# Altium project ADAS_ECU_revA.PrjPcb (part 4 of 6)

## Sheet LM704A0_3V3_PINOUT.SchDoc
size C; SheetNumber: 9; SheetTotal: 25
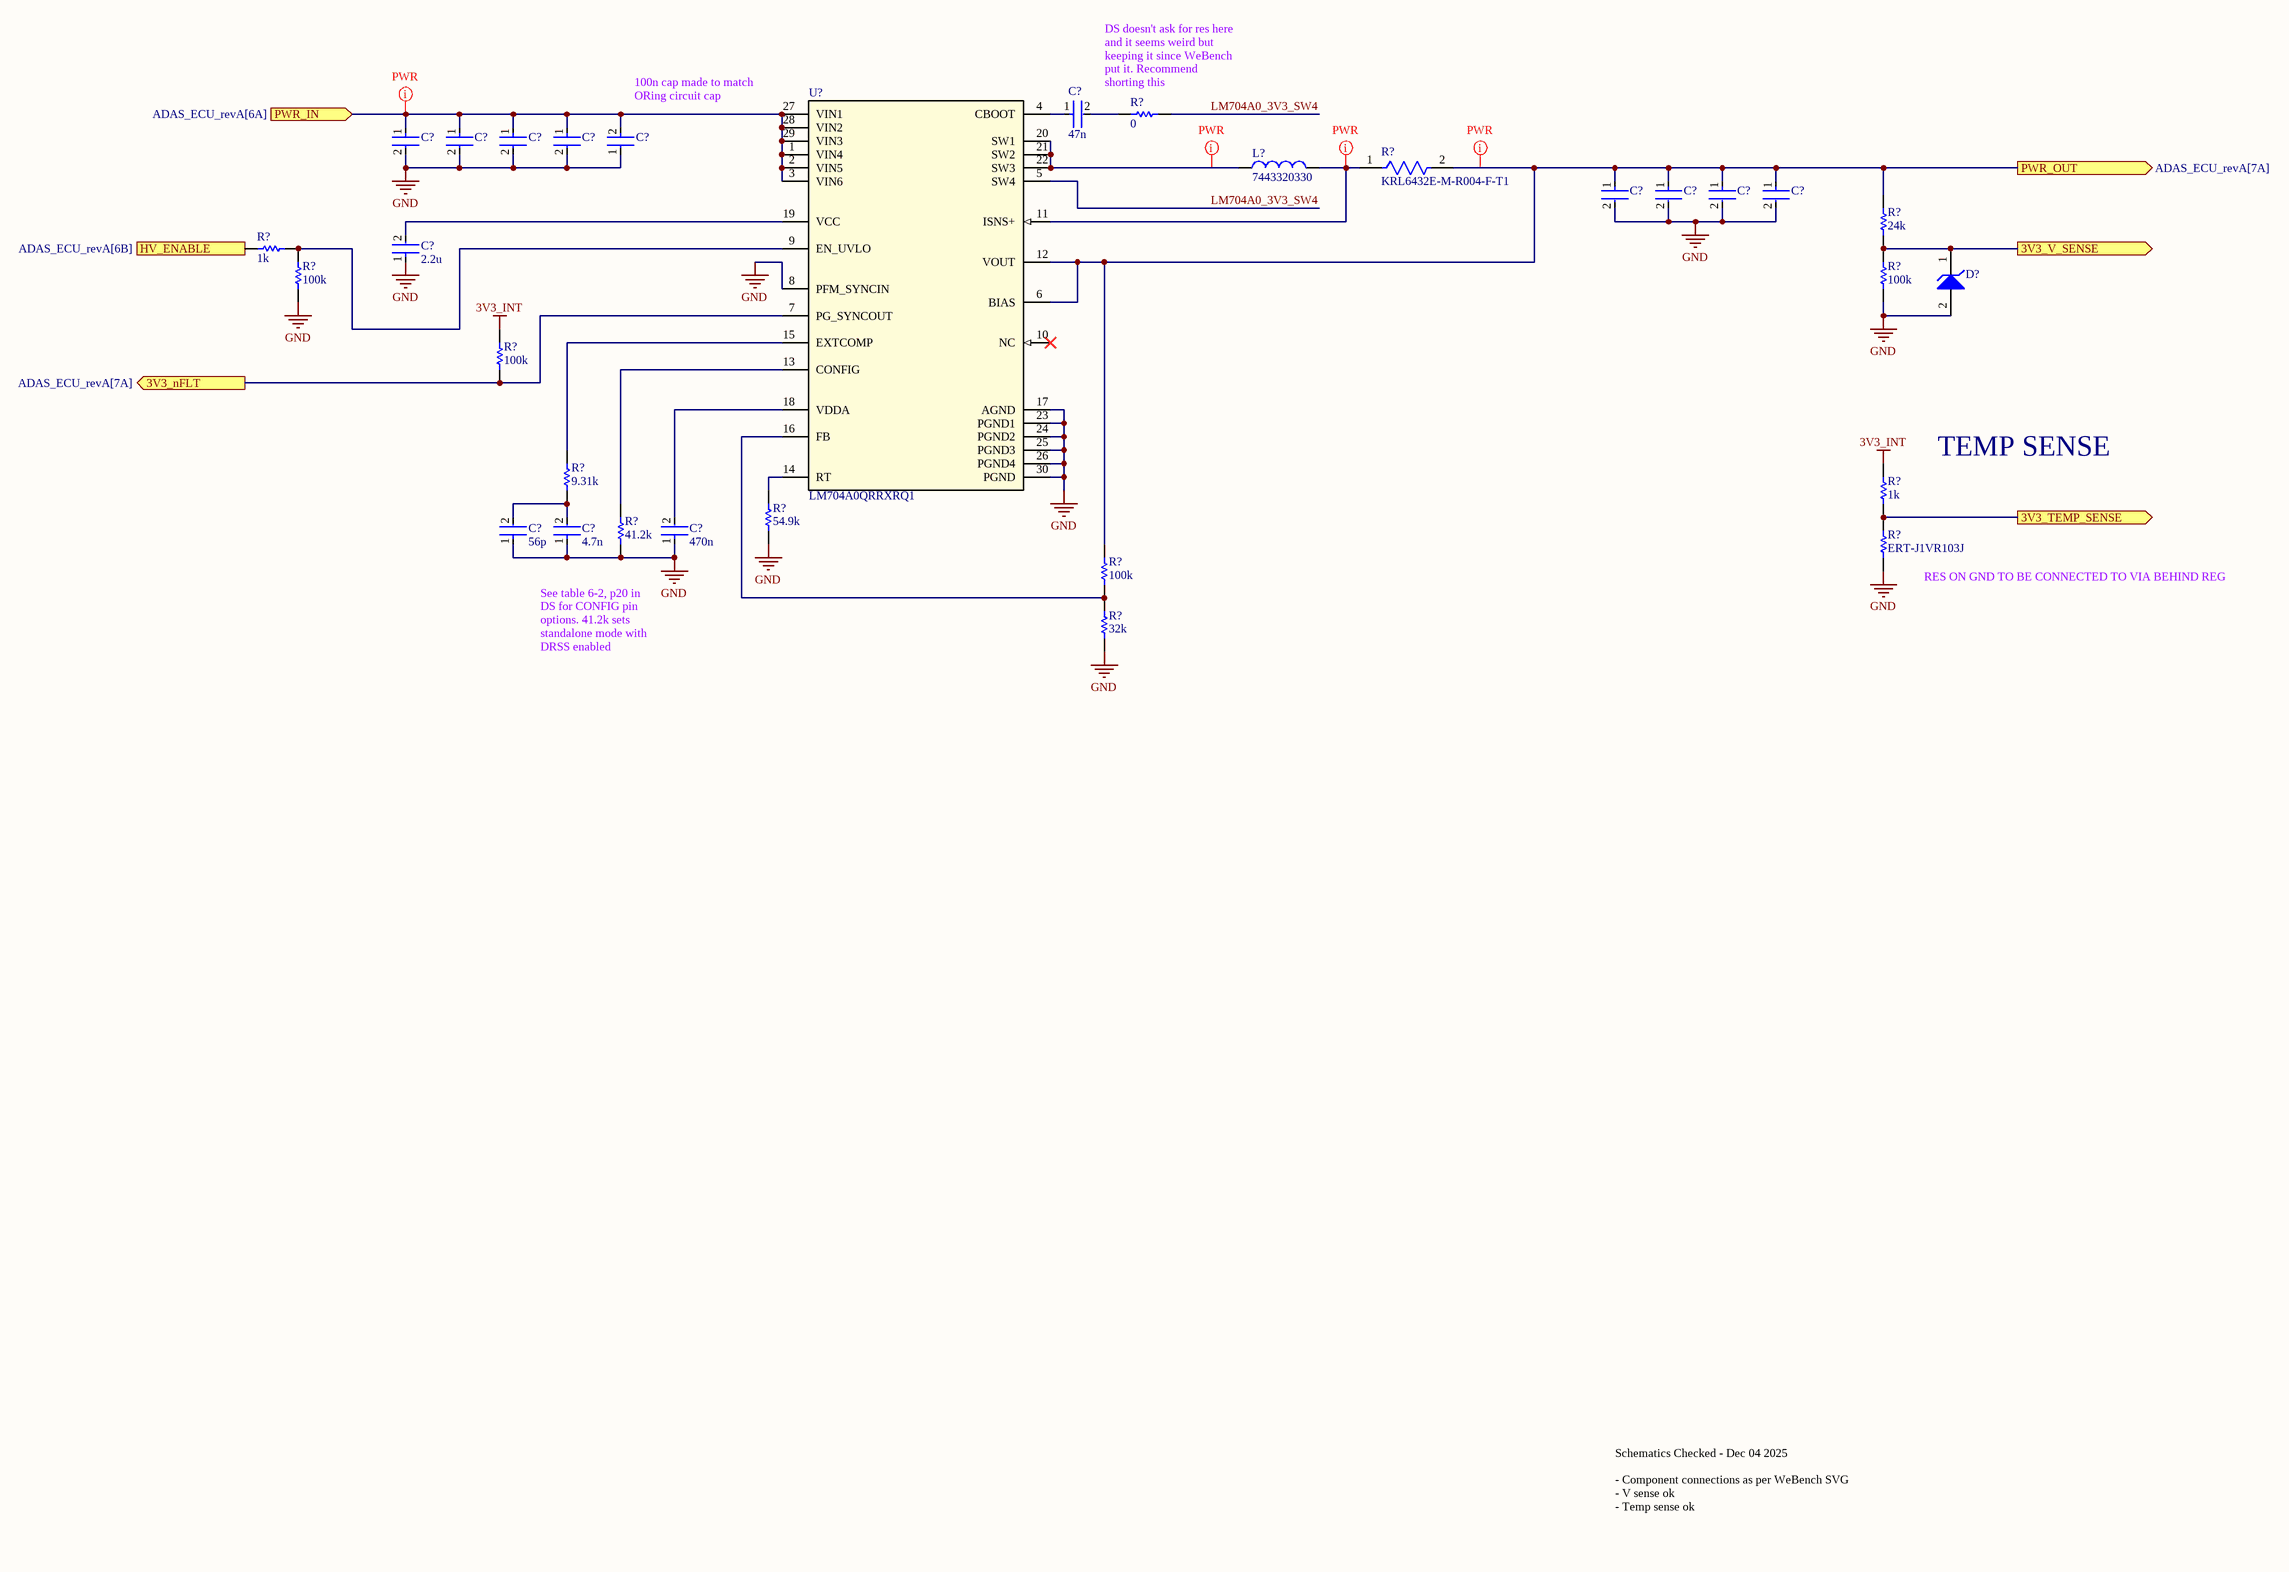
[diagram p29: LM704A0_3V3_PINOUT.SchDoc]

### Parts
(Parts that share a designator on the sheet are numbered #1, #2 ... from top to bottom, then left to right.)
C?#17  47n  [FP-0402-L_1_0_0_05-W_0_5-IPC_A]
C?#18  C3225X7R1H106M250AC  [FP-C3225-250-0_4-MFG]  (value not drawn)
C?#19  C3225X7R1H106M250AC  [FP-C3225-250-0_4-MFG]  (value not drawn)
C?#20  C3225X7R1H106M250AC  [FP-C3225-250-0_4-MFG]  (value not drawn)
C?#21  C3225X7R1H106M250AC  [FP-C3225-250-0_4-MFG]  (value not drawn)
C?#22  AC1210KKX7R0BB104  [FP-AC1210-0_85-MFG]  (value not drawn)
C?#23  GRM32EC80J107ME20L  [FP-GRM32E-0_3-0_2-IPC_C]  (value not drawn)
C?#24  GRM32EC80J107ME20L  [FP-GRM32E-0_3-0_2-IPC_C]  (value not drawn)
C?#25  GRM32EC80J107ME20L  [FP-GRM32E-0_3-0_2-IPC_C]  (value not drawn)
C?#26  GRM32EC80J107ME20L  [FP-GRM32E-0_3-0_2-IPC_C]  (value not drawn)
C?#27  2.2u  [FP-0402-L_1_0_0_05-W_0_5-IPC_A]
C?#28  56p  [FP-0402-L_1_0_0_05-W_0_5-IPC_A]
C?#29  4.7n  [FP-0402-L_1_0_0_05-W_0_5-IPC_A]
C?#30  470n  [FP-0402-L_1_0_0_05-W_0_5-IPC_A]
D?#4  DNP/MM5Z3V3T1G  [ONSC-SOD-523-2-502-01_V]  (value not drawn)
L?  7443320330  [WE-HCC_1210]
R?#10  0  [R0603B]
R?#11  KRL6432E-M-R004-F-T1  [FP-KRL6432E-MFG]
R?#12  24k  [R0603B]
R?#13  1k  [R0603B]
R?#14  100k  [R0603B]
R?#15  100k  [R0603B]
R?#16  100k  [R0603B]
R?#17  9.31k  [R0603B]
R?#18  1k  [R0603B]
R?#19  54.9k  [R0603B]
R?#20  41.2k  [R0603B]
R?#21  ERT-J1VR103J  [RESC1608X90X30ML15T20]
R?#22  100k  [R0603B]
R?#23  32k  [R0603B]
U?#3  LM704A0QRRXRQ1  [LM704A0QRRXRQ1-Footprint-1]

### Ports
3V3_nFLT (out, see ADAS_ECU_revA[7A]), 3V3_TEMP_SENSE (out), 3V3_V_SENSE (out), HV_ENABLE (in, see ADAS_ECU_revA[6B]), PWR_IN (in, see ADAS_ECU_revA[6A]), PWR_OUT (out, see ADAS_ECU_revA[7A])

### Nets
3V3_INT: R?#16.2 R?#18.1
3V3_MAIN: C?#23.1 C?#24.1 C?#25.1 C?#26.1 R?#11.2 R?#12.1 R?#22.1 U?#3.6(BIAS) U?#3.12(VOUT) ; port PWR_OUT
GND: C?#18.2 C?#19.2 C?#20.2 C?#21.2 C?#22.1 C?#23.2 C?#24.2 C?#25.2 C?#26.2 C?#27.1 C?#28.1 C?#29.1 C?#30.1 D?#4.2(A) R?#14.1 R?#15.2 R?#19.2 R?#20.2 R?#21.1 R?#23.2 U?#3.8(PFM_SYNCIN) U?#3.17(AGND) U?#3.23(PGND1) U?#3.24(PGND2) U?#3.25(PGND3) U?#3.26(PGND4) U?#3.30(PGND)
3V3_3V3_MAIN_ENABLE: R?#13.2 ; port HV_ENABLE
3V3_3V3_MAIN_nFLT: R?#16.1 U?#3.7(PG_SYNCOUT) ; port 3V3_nFLT
3V3_3V3_MAIN_T_SENSE: R?#18.2 R?#21.2 ; port 3V3_TEMP_SENSE
3V3_3V3_MAIN_V_SENSE: D?#4.1(K) R?#12.2 R?#15.1 ; port 3V3_V_SENSE
3V3_MAIN_PWR_IN: C?#18.1 C?#19.1 C?#20.1 C?#21.1 C?#22.2 U?#3.1(VIN4) U?#3.2(VIN5) U?#3.3(VIN6) U?#3.27(VIN1) U?#3.28(VIN2) U?#3.29(VIN3) ; port PWR_IN
LM704A0_3V3_SW4: R?#10.2 U?#3.5(SW4)
NetC?#17_1: C?#17.1 U?#3.4(CBOOT)
NetC?#17_2: C?#17.2 R?#10.1
NetC?#27_2: C?#27.2 U?#3.19(VCC)
NetC?#28_2: C?#28.2 C?#29.2 R?#17.2
NetC?#30_2: C?#30.2 U?#3.18(VDDA)
NetL?_1: L?.1 U?#3.20(SW1) U?#3.21(SW2) U?#3.22(SW3)
NetL?_2: L?.2 R?#11.1 U?#3.11(ISNS+)
NetR?#13_1: R?#13.1 R?#14.2 U?#3.9(EN_UVLO)
NetR?#17_1: R?#17.1 U?#3.15(EXTCOMP)
NetR?#19_1: R?#19.1 U?#3.14(RT)
NetR?#20_1: R?#20.1 U?#3.13(CONFIG)
NetR?#22_2: R?#22.2 R?#23.1 U?#3.16(FB)

Not connected (* = marked no-connect by the designer): U?#3 10(NC)*

### Layout directives
net class PWR: 3V3_MAIN, 3V3_MAIN_PWR_IN, NetL?_1, NetL?_2

### Notes on the sheet
- 100n cap made to match ORing circuit cap
- DS doesn't ask for res here and it seems weird but keeping it since WeBench put it. Recommend shorting this
- TEMP SENSE
- (near R?#21) RES ON GND TO BE CONNECTED TO VIA BEHIND REG
- See table 6-2, p20 in DS for CONFIG pin options. 41.2k sets standalone mode with DRSS enabled
- Schematics Checked - Dec 04 2025
  - Component connections as per WeBench SVG
  - V sense ok
  - Temp sense ok

### Library data of the parts
C?#17 C?#27-C?#30 = CMP-001-00058-1: as C66-C70 on sheet LM74910H_PINOUT; Min Operating Temperature: -55°C; Mounting Technology: Surface Mount; Pins: 2; Case/Package: 0402; RoHS Compliant: Yes; Max Operating Temperature: 85°C
C?#18-C?#21 = CMP-08246-002653-1: Multilayer Ceramic Capacitors 10uF ±20% 50V X7R SMD 1210; Width: 0.098inch; Package Quantity: 1000; Height: 2.5mm; Dielectric Material: Ceramic; Voltage Rating: 50V; Series: C; Capacitance: 10uF; Tolerance: 20%; Weight: 0.000564oz; Case/Package: 1210; Case Code (Imperial): 1210; Dielectric: X7R; Case Code (Metric): 3225; REACH SVHC: No SVHC; Packaging: Tape and Reel; Length: 0.126inch; Termination: SMD/SMT; Min Operating Temperature: -55°C; Voltage Rating (DC): 50V; Lead Free: Lead Free; Max Operating Temperature: 125°C; Thickness: 0.11inch; Mount: Surface Mount
C?#22 = CMP-03422-000642-1: CAP CER 0.1UF 100V X7R 1210; Manufacturer: Yageo; Automotive Grade: Grade 1; Capacitance: 100 nF; Material: Ceramic; Value: 100 nF; Temperature Coefficient: 15%; Tolerance: 0.1; Automotive: Yes; ComponentLink2Description: Datasheet; Device Class L2: Capacitors; Height: 0.95mm; Manufacturer Part Number: AC1210KKX7R0BB104; Temperature: -55°C to +125°C; Voltage Rating: 100 V; Device Class L1: Passive Components; ComponentLink2URL: http://www.yageo.com/documents/recent/UPY-AC_NP0X7R_16V-to-630V_12.pdf; Lead Free: Yes; Category: Cap; Temperature Range High: +125°C; RoHS: TRUE; Digikey Description: CAP CER 0.1UF 100V X7R 1210; Temperature Range Low: -55°C; Octopart: https://octopart.com/ac1210kkx7r0bb104-yageo-78873719; Device Class L3: Ceramic Capacitors; Ipc Land Pattern Name: CAPC320250X85; Package: AC1210-0.85; Footprint Url: http://www.yageo.com/exep/pages/download/literatures/UPY-C_GEN_24.pdf; Temperature Characteristic: X7R
C?#23-C?#26 = CMP-2000-06362-2: DIFF P/N 100UF 6.3V GRM32EC80J107ME20L; Voltage: 16V; Tolerance: 10%; Capacitance: 47uF; Dielectric: X5R; Material: Ceramic; Case Code (Metric): 3225; RoHS Compliant: Yes; Min Operating Temperature: -55°C; Radiation Hardening: No; Package Quantity: 1; Case Code (Imperial): 1210; REACH SVHC: No SVHC; Voltage Rating (DC): 16V; Case/Package: 1210; Length: 3.2mm; Voltage Rating: 16V; Packaging: Cut Tape; Width: 0.098inch; Number of Pins: 2; Lead Free: Lead Free; Height: 2.5mm; Mount: Surface Mount; Termination: SMD/SMT; Max Operating Temperature: 85°C; Thickness: 0.106inch; Depth: 2.5mm
D?#4 = CMP-1060-00750-1: Zener Voltage Regulator, 500 mW, 2-Pin SOD-523, Pb-Free, Tape and Reel; Manufacturer: On Semiconductor; P Max (W): 0.5; VZ Typ (V): 3.3; RoHS: Pb-Free; ComponentLink2Description: Datasheet; PackageReference: SOD-523-2-502-01; DatasheetVersion: Rev. 10; ComponentLink1Description: Manufacturer URL; PackageVersion: Rev. E, 09/2010; ComponentLink3URL: http://www.onsemi.com/pub_link/Collateral/502-01.PDF; ComponentLink2URL: http://www.onsemi.cn/pub_link/Collateral/MM5Z2V4T1-D.PDF; Mounting Technology: Surface Mount; PartNumber: MM5Z3V3T1G; Packing: Tape and Reel; PackageDescription: 2-Pin SOD, Body 1.2 x 0.8 mm; ComponentLink1URL: http://www.onsemi.com/; ComponentLink3Description: Package Specification
L? = CMP-0226-00120-2: NexarPartId: 22803324; Self Resonant Frequency: 44MHz; DC Resistance (DCR): 5.2mΩ; Saturation Current: 22.4A; Inductance Tolerance: 20%; Material: Ferrite; Inductance: 3.3µH; Current Rating: 17A; Height: 9.5mm; Number of Pins: 2; Length: 12.1mm; Width: 11.4mm; Packaging: Tape & Reel (TR); Ambient Temperature Range High: 75°C; RoHS: Compliant; Max Operating Temperature: 125°C; Min Operating Temperature: -40°C; Ambient Temperature Range Low: -40°C; Core Material: Ferrite
R?#10 R?#13-R?#20 R?#22 R?#23 = CMP-009-00002-14: Resistor
  R?#15: Value: 100k
  R?#18: Value: 1k
R?#11 = CMP-00597-24927457-1: KRL6432E-M-R004-F-T1 Metal Foil Low Resistance Chip Resistor (long-side terminal), 2512, RoHS; Power Rating: 3W; Temperature Coefficient: 50ppm/°C; Tolerance: 1%; Resistance: 4mΩ; Length: 3.1mm; Composition: Metal Foil; Termination: SMD/SMT; Max Operating Temperature: 155°C; Case Code (Imperial): 2512; NexarPartId: 24927457; Width: 6.3mm; Max Power Dissipation: 3W; Case Code (Metric): 6432; Min Operating Temperature: -55°C; Packaging: Digi-Reel®; Max Thickness: 700µm; Lifecycle Status: Production; Height: 700µm; Weight: 40.511469mg; Case/Package: 2512; RoHS: Compliant; Number of Terminations: 2
R?#12 = CMP-009-00002-14: Resistor; Value: 100k
R?#21 = CMP-2000-00869-1: Manufacturer: Panasonic; Part Number: ERT-J1VR103J
U?#3 = CMP-019-00058-1: Automotive, High-density, 4.5V to 45V input, 10A low-EMI synchronous DC/DC step-down converter 29-VQFN -40 to 150; Case/Package: VQFN; Pins: 29

## Sheet LM5177_PINOUT.SchDoc
size C; SheetNumber: 16; SheetTotal: 19
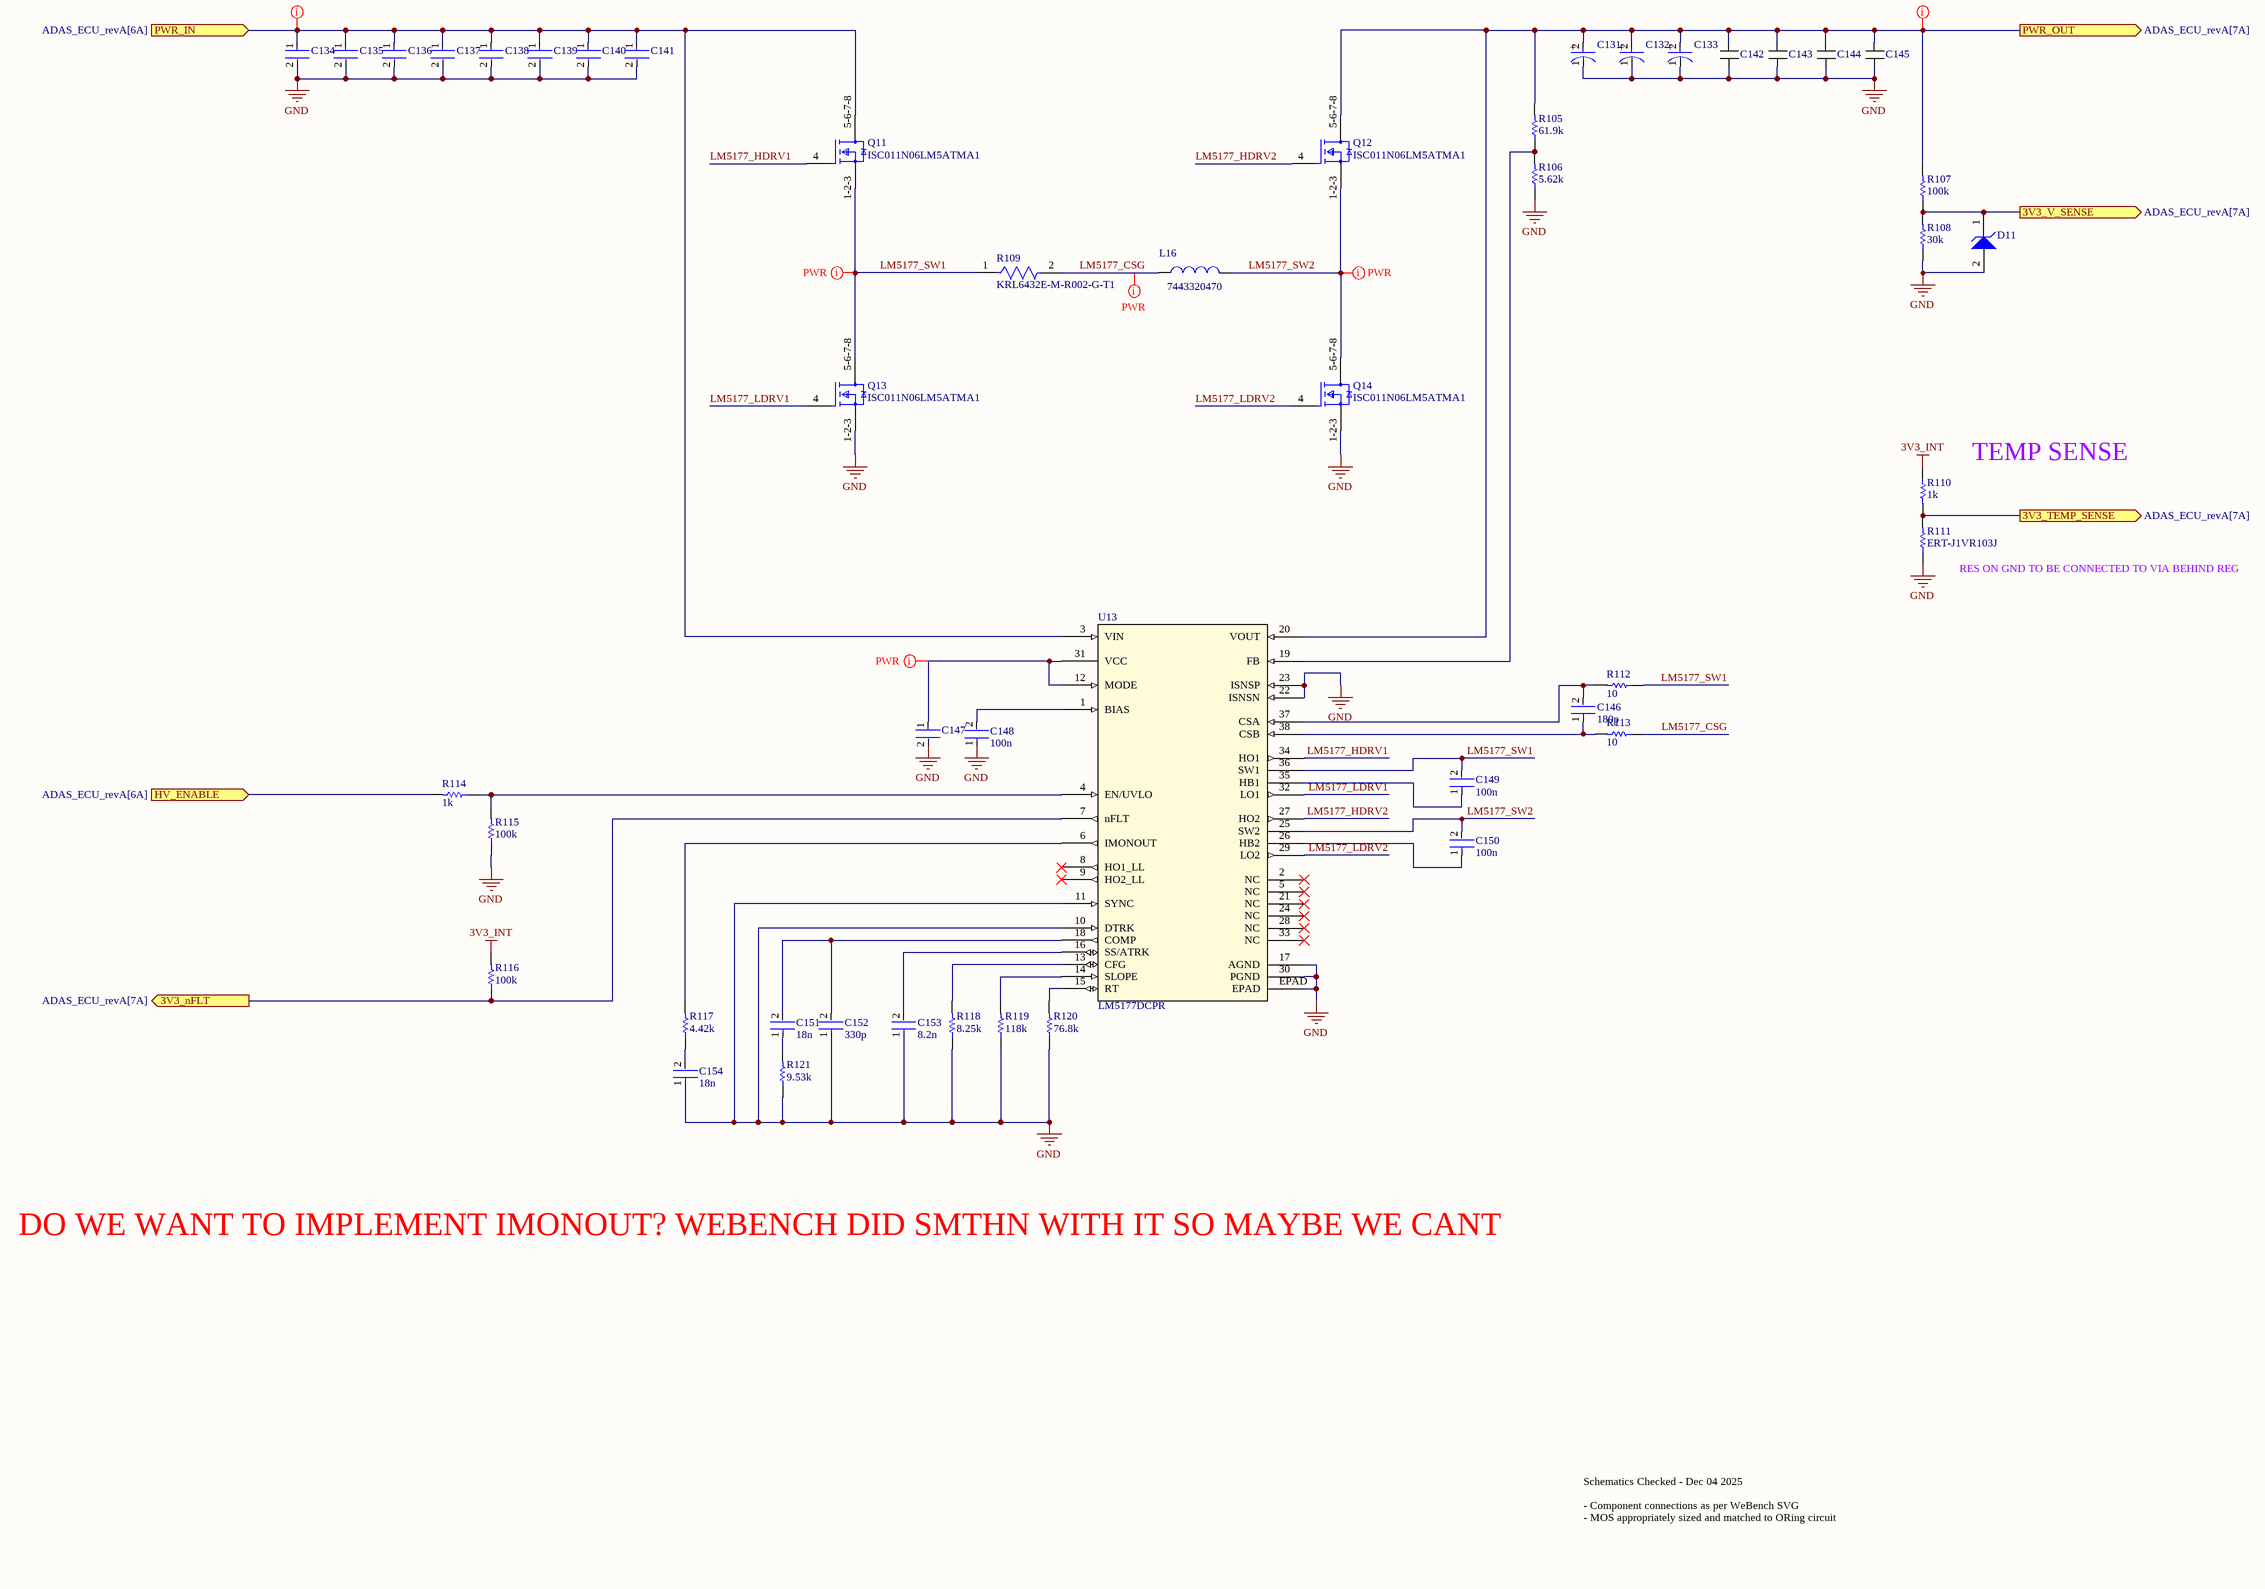
[diagram p30: LM5177_PINOUT.SchDoc]

### Parts
C131  20SVPF120M  [FP-OS-CON-SMT-C6-MFG]  (value not drawn)
C132  20SVPF120M  [FP-OS-CON-SMT-C6-MFG]  (value not drawn)
C133  20SVPF120M  [FP-OS-CON-SMT-C6-MFG]  (value not drawn)
C134  C3225X7R1H106M250AC  [FP-C3225-250-0_4-MFG]  (value not drawn)
C135  C3225X7R1H106M250AC  [FP-C3225-250-0_4-MFG]  (value not drawn)
C136  C3225X7R1H106M250AC  [FP-C3225-250-0_4-MFG]  (value not drawn)
C137  C3225X7R1H106M250AC  [FP-C3225-250-0_4-MFG]  (value not drawn)
C138  C3225X7R1H106M250AC  [FP-C3225-250-0_4-MFG]  (value not drawn)
C139  C3225X7R1H106M250AC  [FP-C3225-250-0_4-MFG]  (value not drawn)
C140  C3225X7R1H106M250AC  [FP-C3225-250-0_4-MFG]  (value not drawn)
C141  C3225X7R1H106M250AC  [FP-C3225-250-0_4-MFG]  (value not drawn)
C142  CGA9P2X7R1E226M250KA  [CGA9P2X7R1E226M250KA-Footprint-1]  (value not drawn)
C143  CGA9P2X7R1E226M250KA  [CGA9P2X7R1E226M250KA-Footprint-1]  (value not drawn)
C144  CGA9P2X7R1E226M250KA  [CGA9P2X7R1E226M250KA-Footprint-1]  (value not drawn)
C145  CGA9P2X7R1E226M250KA  [CGA9P2X7R1E226M250KA-Footprint-1]  (value not drawn)
C146  180p  [FP-0402-L_1_0_0_05-W_0_5-IPC_A]
C147  GRM188R60J226MEA0D  [FP-GRM188-0_1-e0_2_0_5-MFG]  (value not drawn)
C148  100n  [FP-0402-L_1_0_0_05-W_0_5-IPC_A]
C149  100n  [FP-0402-L_1_0_0_05-W_0_5-IPC_A]
C150  100n  [FP-0402-L_1_0_0_05-W_0_5-IPC_A]
C151  18n  [FP-0402-L_1_0_0_05-W_0_5-IPC_A]
C152  330p  [FP-0402-L_1_0_0_05-W_0_5-IPC_A]
C153  8.2n  [FP-0402-L_1_0_0_05-W_0_5-IPC_A]
C154  18n  [FP-0402-L_1_0_0_05-W_0_5-IPC_A]
D11  MM5Z3V3T1G  [ONSC-SOD-523-2-502-01_V]  (value not drawn)
L16  7443320470  [WE-HCC_1210]
Q11  ISC011N06LM5ATMA1  [FP-PG-TDSON-8-MFG]
Q12  ISC011N06LM5ATMA1  [FP-PG-TDSON-8-MFG]
Q13  ISC011N06LM5ATMA1  [FP-PG-TDSON-8-MFG]
Q14  ISC011N06LM5ATMA1  [FP-PG-TDSON-8-MFG]
R105  61.9k  [R0603B]
R106  5.62k  [R0603B]
R107  100k  [R0603B]
R108  30k  [R0603B]
R109  KRL6432E-M-R002-G-T1  [FP-KRL6432E-MFG]
R110  1k  [R0603B]
R111  ERT-J1VR103J  [RESC1608X90X30ML15T20]
R112  10  [R0603B]
R113  10  [R0603B]
R114  1k  [R0603B]
R115  100k  [R0603B]
R116  100k  [R0603B]
R117  4.42k  [R0603B]
R118  8.25k  [R0603B]
R119  118k  [R0603B]
R120  76.8k  [R0603B]
R121  9.53k  [R0603B]
U13  LM5177DCPR  [LM5177DCPR-Footprint-1]

### Ports
3V3_nFLT (out, see ADAS_ECU_revA[7A]), 3V3_TEMP_SENSE (out, see ADAS_ECU_revA[7A]), 3V3_V_SENSE (out, see ADAS_ECU_revA[7A]), HV_ENABLE (in, see ADAS_ECU_revA[6A]), PWR_IN (in, see ADAS_ECU_revA[6A]), PWR_OUT (out, see ADAS_ECU_revA[7A])

### Nets
3V3_INT: R110.1 R116.2
12V0_MAIN: C131.2(A) C132.2(A) C133.2(A) C142.1 C143.1 C144.1 C145.1 Q12.5-6-7-8(D) R105.2 R107.2 U13.20(VOUT) ; port PWR_OUT
GND: C131.1(C) C132.1(C) C133.1(C) C134.2 C135.2 C136.2 C137.2 C138.2 C139.2 C140.2 C141.2 C142.2 C143.2 C144.2 C145.2 C147.2 C148.1 C152.1 C153.1 C154.1 D11.2(A) Q13.1-2-3(S) Q14.1-2-3(S) R106.1 R108.1 R111.1 R115.1 R118.1 R119.1 R120.1 R121.1 U13.10(DTRK) U13.11(SYNC) U13.17(AGND) U13.22(ISNSN) U13.23(ISNSP) U13.30(PGND) U13.EPAD
3V3_12V0_MAIN_ENABLE: R114.2 ; port HV_ENABLE
3V3_12V_MAIN_nFLT: R116.1 U13.7(nFLT) ; port 3V3_nFLT
3V3_12V_MAIN_T_SENSE: R110.2 R111.2 ; port 3V3_TEMP_SENSE
3V3_12V_MAIN_V_SENSE: D11.1(K) R107.1 R108.2 ; port 3V3_V_SENSE
12V0_MAIN_PWR_IN: C134.1 C135.1 C136.1 C137.1 C138.1 C139.1 C140.1 C141.1 Q11.5-6-7-8(D) U13.3(VIN) ; port PWR_IN
LM5177_CSG: L16.1 R109.2 R113.1
LM5177_HDRV1: Q11.4(G) U13.34(HO1)
LM5177_HDRV2: Q12.4(G) U13.27(HO2)
LM5177_LDRV1: Q13.4(G) U13.32(LO1)
LM5177_LDRV2: Q14.4(G) U13.29(LO2)
LM5177_SW1: C149.2 Q11.1-2-3(S) Q13.5-6-7-8(D) R109.1 R112.1 U13.36(SW1)
LM5177_SW2: C150.2 L16.2 Q12.1-2-3(S) Q14.5-6-7-8(D) U13.25(SW2)
NetC146_1: C146.1 R113.2 U13.38(CSB)
NetC146_2: C146.2 R112.2 U13.37(CSA)
NetC147_1: C147.1 U13.12(MODE) U13.31(VCC)
NetC148_2: C148.2 U13.1(BIAS)
NetC149_1: C149.1 U13.35(HB1)
NetC150_1: C150.1 U13.26(HB2)
NetC151_1: C151.1 R121.2
NetC151_2: C151.2 C152.2 U13.18(COMP)
NetC153_2: C153.2 U13.16(SS/ATRK)
NetC154_2: C154.2 R117.1
NetR105_1: R105.1 R106.2 U13.19(FB)
NetR114_1: R114.1 R115.2 U13.4(EN/UVLO)
NetR117_2: R117.2 U13.6(IMONOUT)
NetR118_2: R118.2 U13.13(CFG)
NetR119_2: R119.2 U13.14(SLOPE)
NetR120_2: R120.2 U13.15(RT)

Not connected (* = marked no-connect by the designer): U13 2(NC)* 5(NC)* 8(HO1_LL)* 9(HO2_LL)* 21(NC)* 24(NC)* 28(NC)* 33(NC)*

### Layout directives
net class PWR: 12V0_MAIN, 12V0_MAIN_PWR_IN, LM5177_CSG, LM5177_SW1, LM5177_SW2, NetC147_1

### Notes on the sheet
- TEMP SENSE
- (near R111) RES ON GND TO BE CONNECTED TO VIA BEHIND REG
- DO WE WANT TO IMPLEMENT IMONOUT? WEBENCH DID SMTHN WITH IT SO MAYBE WE CANT
- Schematics Checked - Dec 04 2025
  - Component connections as per WeBench SVG
  - MOS appropriately sized and matched to ORing circuit
- (in symbol CMP-05428-001333-1) +

### Library data of the parts
C131-C133 = CMP-05428-001333-1: Conductive Polymer Aluminum Solid Capacitors (OS-CON) 120uF ±20% 20V; Polarity: Polar; ESR (Equivalent Series Resistance): 25mR; Leakage Current: 480uA; Ripple Current: 3.2A; Life (Hours): 5000Hour; Dissipation Factor: 12%; Lead Free: Lead Free; Voltage Rating: 20V; Packaging: Tape and Reel; Min Operating Temperature: -55°C; Tolerance: 20%; Diameter: 6.3mm; Max Operating Temperature: 105°C; Length: 5.9mm; Termination: SMD/SMT; Height - Seated (Max): 0.236inch; REACH SVHC: No SVHC; Voltage Rating (DC): 20V; Voltage: 20V; Material: Polymer; Ripple Current (AC): 3.2A; Series: OS-CON™, SVPF; RoHS Compliant: Yes; Mount: Surface Mount; Height: 5.9mm; Package Quantity: 1000; Radiation Hardening: No; Construction: Cylindrical; Case/Package: Radial; Capacitance: 120uF; Number of Pins: 6
C134-C141 = CMP-08246-002653-1: as C?#18 on sheet LM704A0_3V3_PINOUT; Width: 0.098inch; Package Quantity: 1000; Height: 2.5mm; Dielectric Material: Ceramic; Voltage Rating: 50V; Series: C; Capacitance: 10uF; Tolerance: 20%; Weight: 0.000564oz; Case/Package: 1210; Case Code (Imperial): 1210; Dielectric: X7R; Case Code (Metric): 3225; REACH SVHC: No SVHC; Packaging: Tape and Reel; Length: 0.126inch; Termination: SMD/SMT; Min Operating Temperature: -55°C; Voltage Rating (DC): 50V; Lead Free: Lead Free; Max Operating Temperature: 125°C; Thickness: 0.11inch; Mount: Surface Mount
C142-C145 = CMP-001-00071-1: 25V 22uF X7R 卤20% 2220 Multilayer Ceramic Capacitors MLCC - SMD/SMT ROHS; Tolerance: 20%; Value: 22µF; Mounting Technology: Surface Mount; Voltage Rating: 25V; Min Operating Temperature: -55°C; Case/Package: 2220; Max Operating Temperature: 125°C
C146 C148-C154 = CMP-001-00058-1: as C66-C70 on sheet LM74910H_PINOUT; Min Operating Temperature: -55°C; Mounting Technology: Surface Mount; Pins: 2; Case/Package: 0402; RoHS Compliant: Yes; Max Operating Temperature: 85°C
C147 = CMP-2006-02836-2: 22uF cap, diff pn; Voltage: 10V; Dielectric: X7R; Material: Ceramic; Capacitance: 2.2uF; Tolerance: 10%; Case Code (Metric): 1608; Height: 0.8mm; Packaging: Cut Tape; Lead Free: Lead Free; Min Operating Temperature: -55°C; Voltage Rating (DC): 10V; Max Operating Temperature: 125°C; Voltage Rating: 10V; Depth: 0.8mm; Case Code (Imperial): 0603; Termination: SMD/SMT; Case/Package: 0603; Number of Pins: 2; REACH SVHC: No SVHC; Mount: Surface Mount; Width: 0.031inch; Package Quantity: 1; Weight: 7.1E-05oz; Length: 1.6mm; Thickness: 0.035inch
D11 = CMP-1060-00750-1: as D?#4 on sheet LM704A0_3V3_PINOUT; RoHS: Pb-Free; ComponentLink2Description: Datasheet; PackageReference: SOD-523-2-502-01; DatasheetVersion: Rev. 10; ComponentLink1Description: Manufacturer URL; PackageVersion: Rev. E, 09/2010; ComponentLink3URL: http://www.onsemi.com/pub_link/Collateral/502-01.PDF; ComponentLink2URL: http://www.onsemi.cn/pub_link/Collateral/MM5Z2V4T1-D.PDF; Mounting Technology: Surface Mount; PartNumber: MM5Z3V3T1G; Packing: Tape and Reel; PackageDescription: 2-Pin SOD, Body 1.2 x 0.8 mm; ComponentLink1URL: http://www.onsemi.com/; ComponentLink3Description: Package Specification
L16 = CMP-0226-00121-3: We-hcc Series, Shielded Wire-wound SMD Inductor With Ferrite Core, 4.7 Uh; Inductance Tolerance: 20%; Self Resonant Frequency: 43MHz; Saturation Current: 15.6A; Current Rating: 15.5A; Inductance: 4.7µH; DC Resistance (DCR): 7.25mΩ; Width: 11.4mm; Core Material: Ferrite; Number of Pins: 2; Material: Ferrite; RoHS: Compliant; Length: 12.1mm; Max Operating Temperature: 125°C; Ambient Temperature Range Low: -40°C; Min Operating Temperature: -40°C; Height: 9.5mm; Ambient Temperature Range High: 75°C
Q11-Q14 = CMP-32901-001049-1: TRENCH 40<-<100V PG-TDSON-8
R105-R108 R110 R112-R121 = CMP-009-00002-14: Resistor
  R110: Value: 1k
R109 = CMP-00597-24927455-1: KRL6432E-M-R002-G-T1 Metal Foil Low Resistance Chip Resistor (long-side terminal), 2512, RoHS; Power Rating: 3W; Tolerance: 2%; Resistance: 2mΩ; Temperature Coefficient: 100ppm/°C; Width: 6.3mm; Termination: SMD/SMT; Weight: 40.511469mg; RoHS: Compliant; Lifecycle Status: Production; Case Code (Imperial): 2512; Case Code (Metric): 6432; Case/Package: 2512; Height: 700µm; Length: 3.1mm; Max Thickness: 700µm; Min Operating Temperature: -55°C; NexarPartId: 24927455; Composition: Metal Foil; Max Operating Temperature: 155°C
R111 = CMP-2000-00869-1: Manufacturer: Panasonic; Part Number: ERT-J1VR103J
U13 = CMP-019-00059-2: IC Buck-Boost Regulator Positive Output Step-Up/Step-Down DC-DC Controller IC 38-HTSSOP; Pins: 38

## Sheet JETSON_PWR_MUX.SchDoc
size B; SheetNumber: 18; SheetTotal: 19
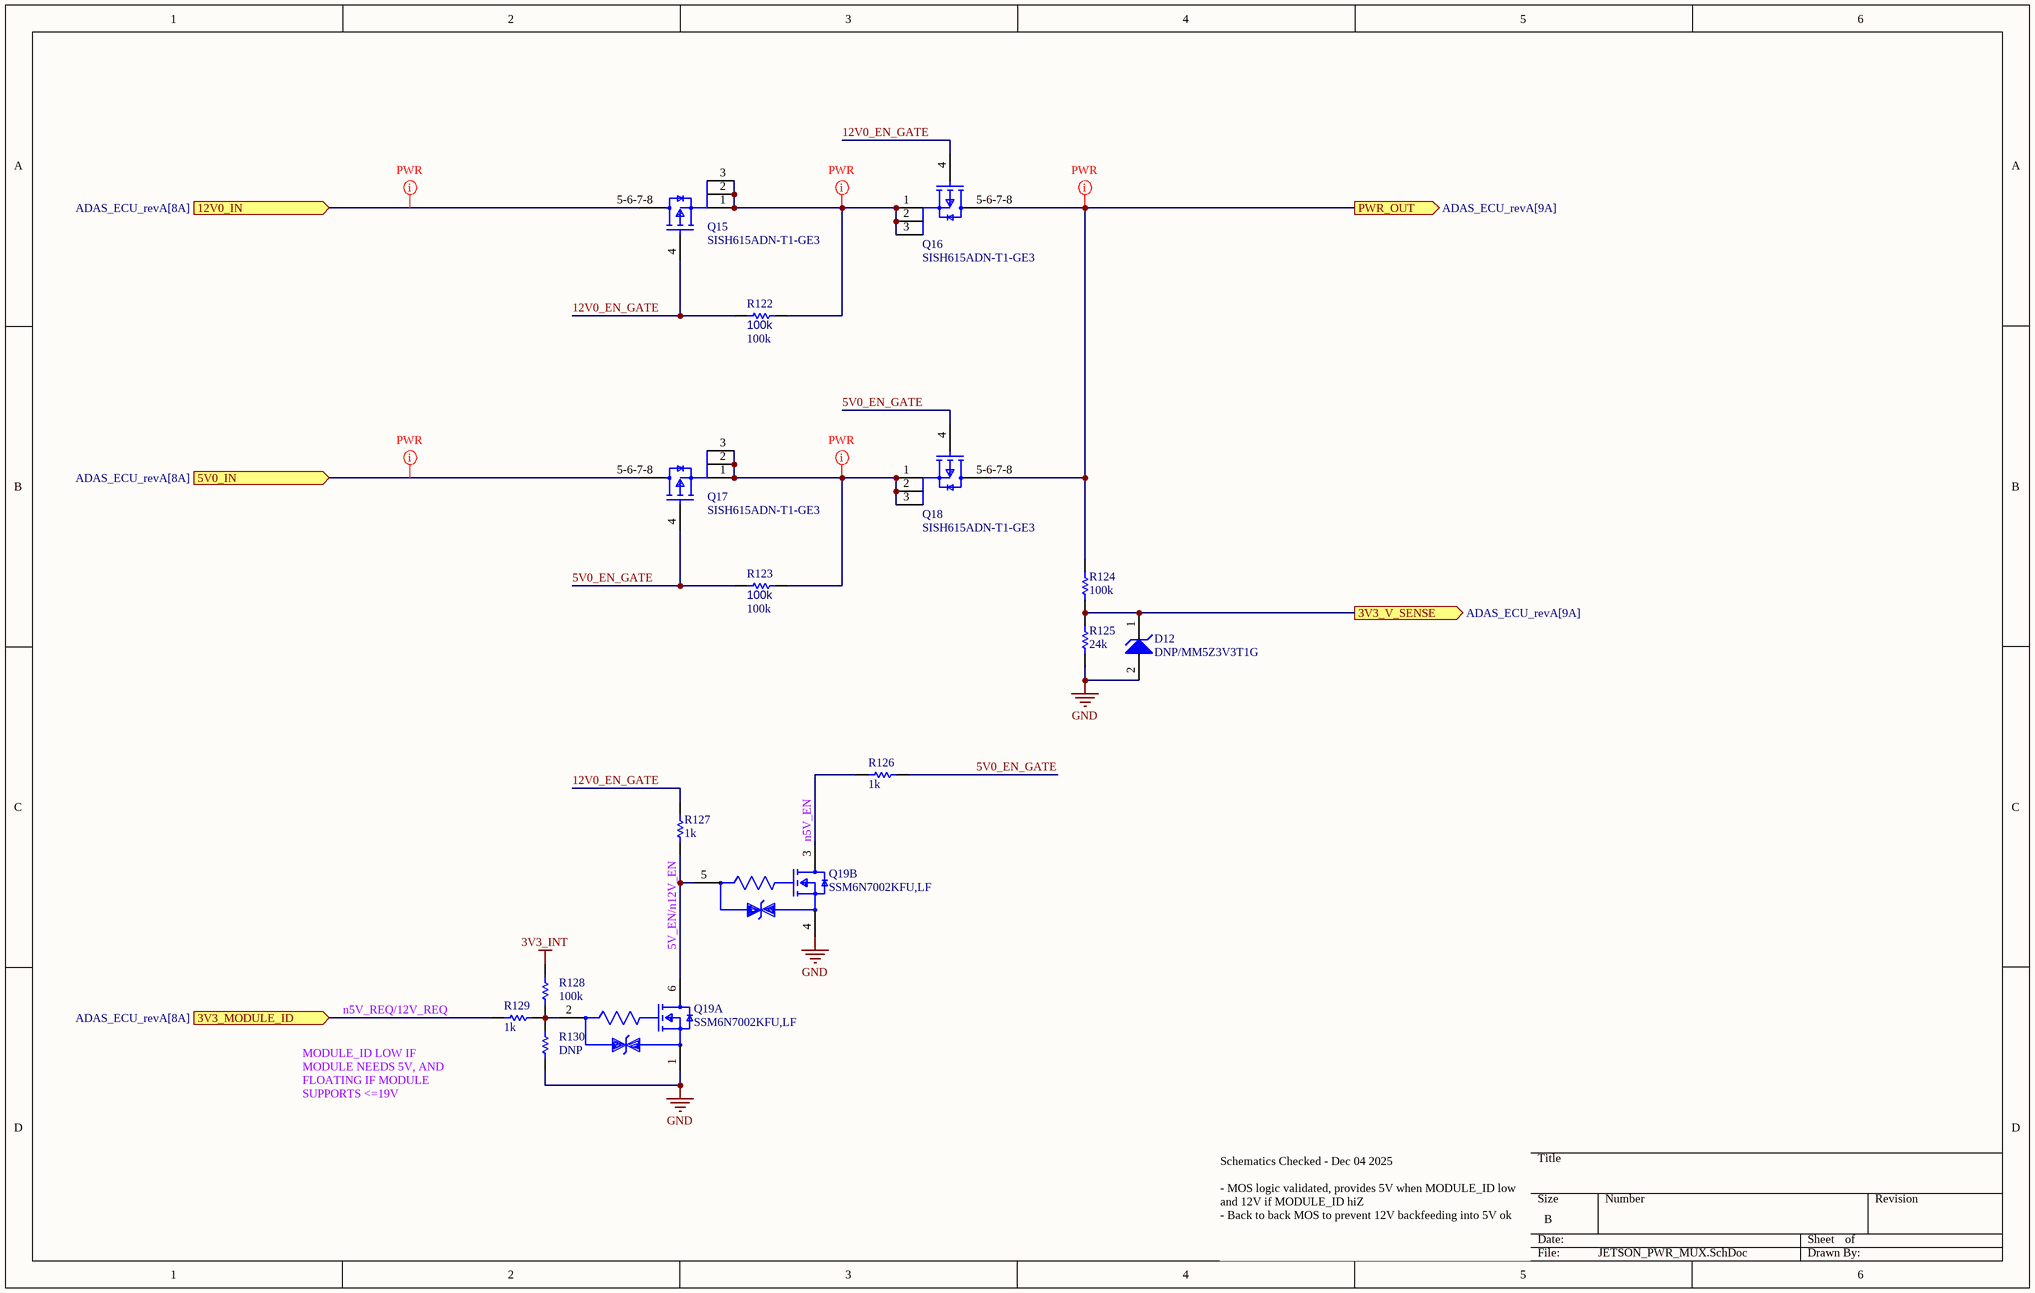
[diagram p31: JETSON_PWR_MUX.SchDoc]

### Parts
D12  DNP/MM5Z3V3T1G  [ONSC-SOD-523-2-502-01_V]
Q15  SISH615ADN-T1-GE3  [SISH615ADN-T1-GE3-Footprint-1]
Q16  SISH615ADN-T1-GE3  [SISH615ADN-T1-GE3-Footprint-1]
Q17  SISH615ADN-T1-GE3  [SISH615ADN-T1-GE3-Footprint-1]
Q18  SISH615ADN-T1-GE3  [SISH615ADN-T1-GE3-Footprint-1]
Q19  SSM6N7002KFU,LF  [FP-SSOP6-P-0_65A-MFG]  (parts A,B of 2)
R122  100k  [R0603B]
R123  100k  [R0603B]
R124  100k  [R0603B]
R125  24k  [R0603B]
R126  1k  [R0603B]
R127  1k  [R0603B]
R128  100k  [R0603B]
R129  1k  [R0603B]
R130  DNP  [R0603B]

### Ports
3V3_MODULE_ID (in, see ADAS_ECU_revA[8A]), 3V3_V_SENSE (out, see ADAS_ECU_revA[9A]), 5V0_IN (in, see ADAS_ECU_revA[8A]), 12V0_IN (in, see ADAS_ECU_revA[8A]), PWR_OUT (out, see ADAS_ECU_revA[9A])

### Nets
3V3_INT: R128.1
5V0_JETSON: Q17.5-6-7-8(D) ; port 5V0_IN
12V0_JETSON: Q15.5-6-7-8(D) ; port 12V0_IN
GND: D12.2(A) Q19.1(Source1) Q19.4(Source2) R125.1 R130.2
JETSON_VCC: Q16.5-6-7-8(D) Q18.5-6-7-8(D) R124.2 ; port PWR_OUT
3V3_JETSON_VCC_V_SENSE: D12.1(K) R124.1 R125.2 ; port 3V3_V_SENSE
3V3_MODULE_ID: R129.1 ; port 3V3_MODULE_ID
5V0_EN_GATE: Q17.4(G) Q18.4(G) R123.2 R126.2
12V0_EN_GATE: Q15.4(G) Q16.4(G) R122.2 R127.2
NetQ15_1: Q15.1(S) Q15.2(S) Q15.3(S) Q16.1(S) Q16.2(S) Q16.3(S) R122.1
NetQ17_1: Q17.1(S) Q17.2(S) Q17.3(S) Q18.1(S) Q18.2(S) Q18.3(S) R123.1
NetQ19_2: Q19.2(Gate1) R128.2 R129.2 R130.1
NetQ19_3: Q19.3(Drain2) R126.1
NetQ19_5: Q19.5(Gate2) Q19.6(Drain1) R127.1

### Layout directives
net class PWR: 5V0_JETSON, 12V0_JETSON, JETSON_VCC, NetQ15_1, NetQ17_1

### Notes on the sheet
- (near Q19) n5V_EN
- 5V_EN/n12V_EN
- n5V_REQ/12V_REQ
- MODULE_ID LOW IF MODULE NEEDS 5V, AND FLOATING IF MODULE SUPPORTS <=19V
- Schematics Checked - Dec 04 2025
  - MOS logic validated, provides 5V when MODULE_ID low and 12V if MODULE_ID hiZ
  - Back to back MOS to prevent 12V backfeeding into 5V ok

### Library data of the parts
D12 = CMP-1060-00750-1: as D?#4 on sheet LM704A0_3V3_PINOUT; RoHS: Pb-Free; ComponentLink2Description: Datasheet; PackageReference: SOD-523-2-502-01; DatasheetVersion: Rev. 10; ComponentLink1Description: Manufacturer URL; PackageVersion: Rev. E, 09/2010; ComponentLink3URL: http://www.onsemi.com/pub_link/Collateral/502-01.PDF; ComponentLink2URL: http://www.onsemi.cn/pub_link/Collateral/MM5Z2V4T1-D.PDF; Mounting Technology: Surface Mount; PartNumber: MM5Z3V3T1G; Packing: Tape and Reel; PackageDescription: 2-Pin SOD, Body 1.2 x 0.8 mm; ComponentLink1URL: http://www.onsemi.com/; ComponentLink3Description: Package Specification
Q15-Q18 = CMP-013-00018-2: Trans MOSFET P-CH 20V 22.1A 8-Pin PowerPAK 1212 EP T/R; Source: SISH615ADN-T1-GE3.SchLib; Design Item ID: CMP-013-00036-4; Component Type: Standard; Pins: 5
Q19 = CMP-35916-000009-1: MOSFET 2N-CH 60V 0.3A; Input Capacitance: 40pF; Continuous Drain Current (ID): 300mA; Max Power Dissipation: 285mW; FET Type: 2 N-Channel; Rds On Max: 1.5R; Mount: Surface Mount; Drain to Source Voltage (Vdss): 60V; Packaging: Tape and Reel
R122-R130 = CMP-009-00002-14: Resistor
  R122-R124: Value: 100k
  R125: Value: 24k
  R130: Value: DNP

## Sheet FUSE_AND_VI_SENSE.SchDoc
size B; SheetNumber: 19; SheetTotal: 19
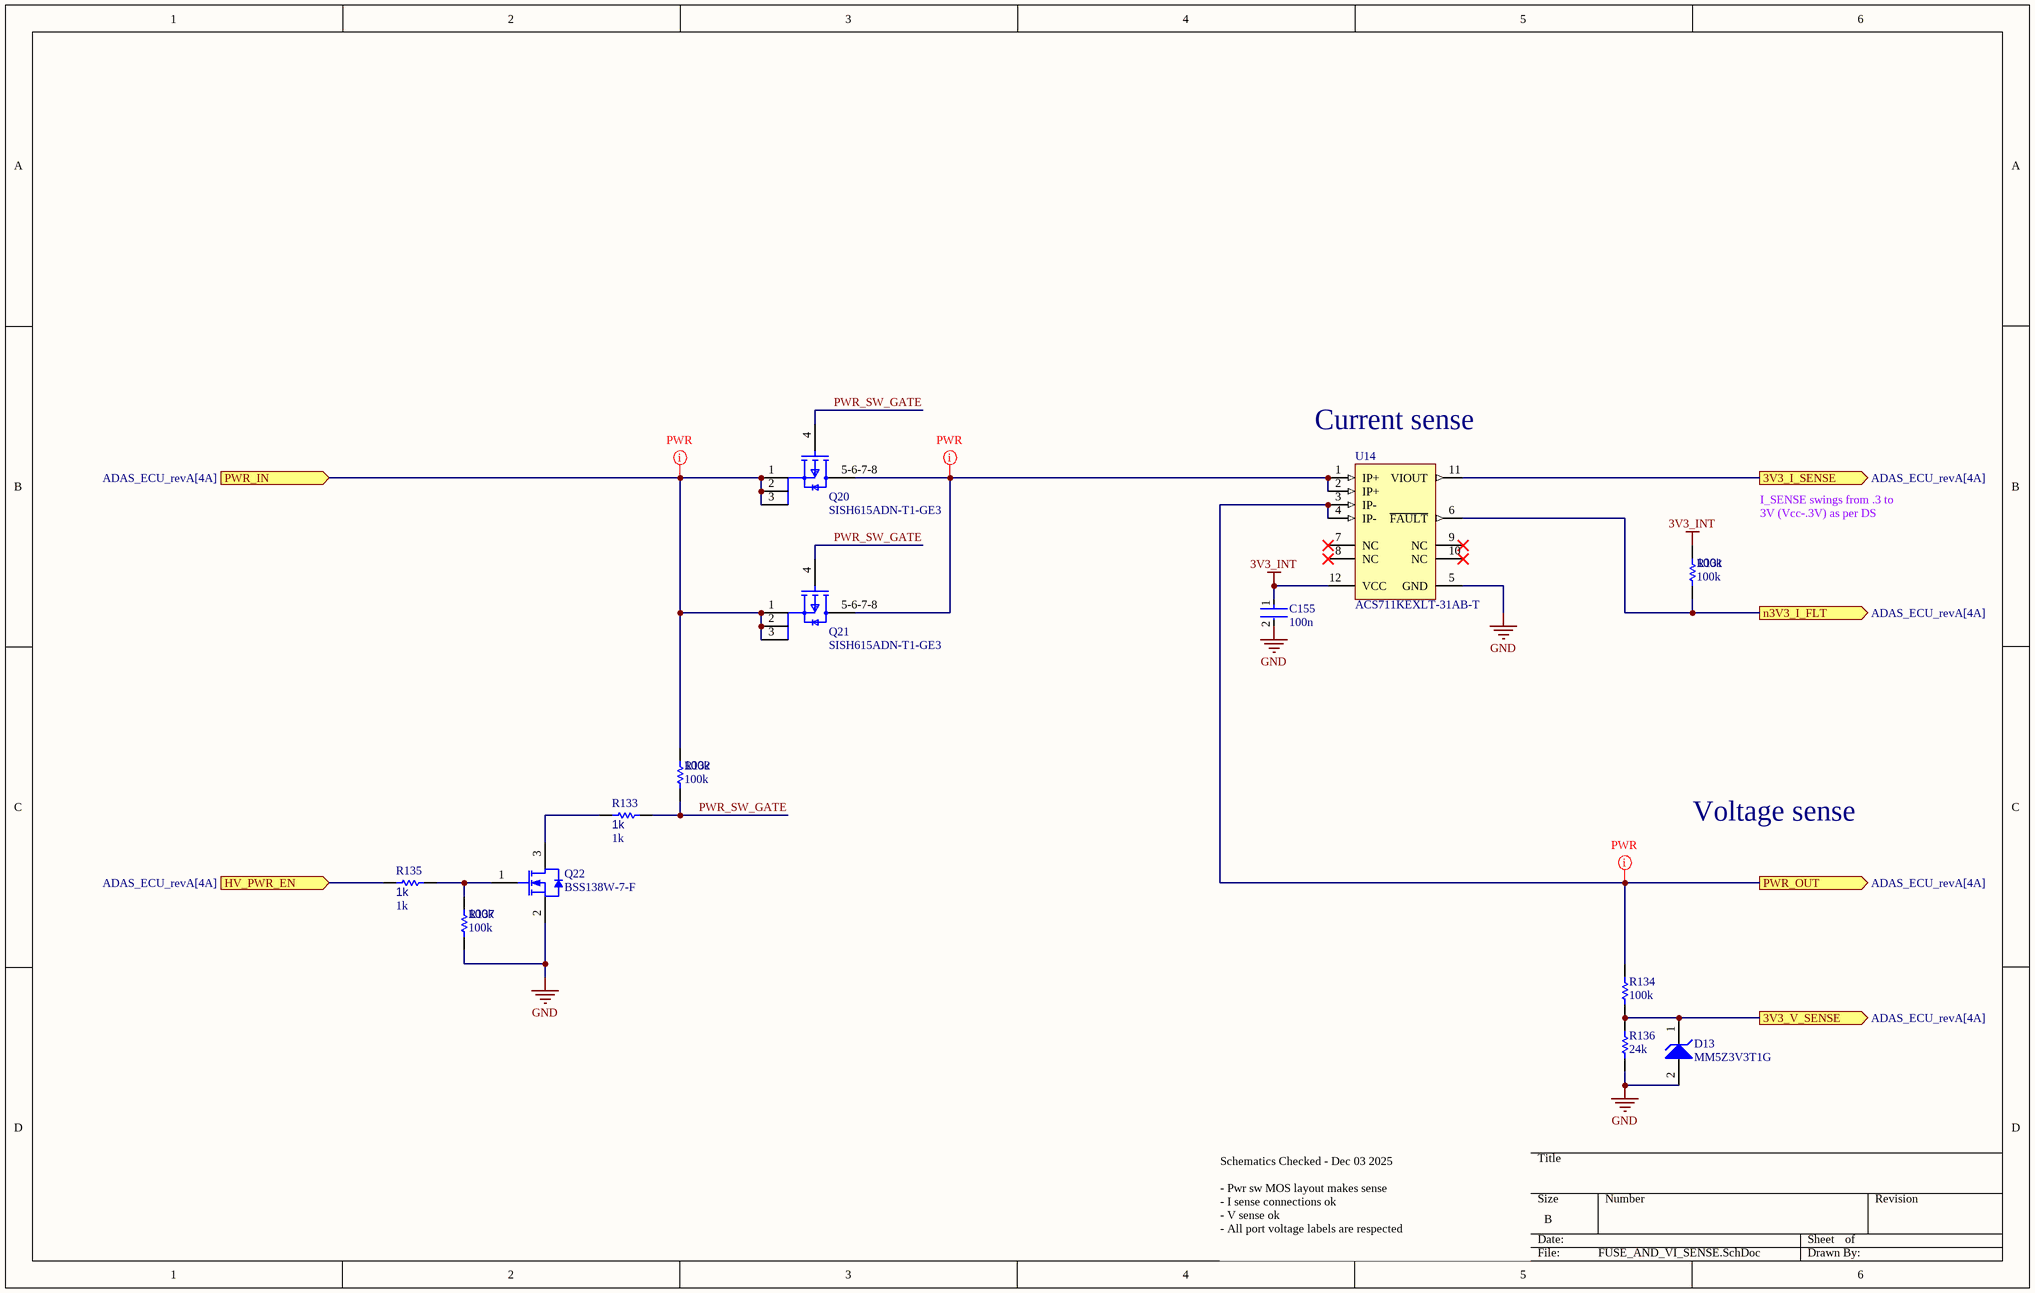
[diagram p32: FUSE_AND_VI_SENSE.SchDoc]

### Parts
C155  100n  [FP-0402-L_1_0_0_05-W_0_5-IPC_A]
D13  MM5Z3V3T1G  [ONSC-SOD-523-2-502-01_V]
Q20  SISH615ADN-T1-GE3  [SISH615ADN-T1-GE3-Footprint-1]
Q21  SISH615ADN-T1-GE3  [SISH615ADN-T1-GE3-Footprint-1]
Q22  BSS138W-7-F  [DIOD-SOT323-3_V]
R131  100k  [R0603B]
R132  100k  [R0603B]
R133  1k  [R0603B]
R134  100k  [R0603B]
R135  1k  [R0603B]
R136  24k  [R0603B]
R137  100k  [R0603B]
U14  ACS711KEXLT-31AB-T  [ALEG-EX-12_V]

### Ports
3V3_I_SENSE (out, see ADAS_ECU_revA[4A]), 3V3_V_SENSE (out, see ADAS_ECU_revA[4A]), HV_PWR_EN (in, see ADAS_ECU_revA[4A]), n3V3_I_FLT (out, see ADAS_ECU_revA[4A]), PWR_IN (in, see ADAS_ECU_revA[4A]), PWR_OUT (out, see ADAS_ECU_revA[4A])

### Nets
3V3_INT: C155.1 R131.2 U14.12(VCC)
GND: C155.2 D13.2(A) Q22.2(S) R136.1 R137.1 U14.5(GND)
INT_VCC: R134.2 U14.3(IP-) U14.4(IP-) ; port PWR_OUT
PRE_VCC: Q20.1(S) Q20.2(S) Q20.3(S) Q21.1(S) Q21.2(S) Q21.3(S) R132.2 ; port PWR_IN
3V3_INPUT_I_SENSE: U14.11(VIOUT) ; port 3V3_I_SENSE
3V3_INPUT_nI_FLT: R131.1 U14.6(~{FAULT}) ; port n3V3_I_FLT
3V3_INPUT_V_SENSE: D13.1(K) R134.1 R136.2 ; port 3V3_V_SENSE
HV_PWR_EN: R135.1 ; port HV_PWR_EN
PWR_SW_GATE: Q20.4(G) Q21.4(G) R132.1 R133.2
NetQ20_5-6-7-8: Q20.5-6-7-8(D) Q21.5-6-7-8(D) U14.1(IP+) U14.2(IP+)
NetQ22_1: Q22.1(G) R135.2 R137.2
NetQ22_3: Q22.3(D) R133.1

Not connected (* = marked no-connect by the designer): U14 7(NC)* 8(NC)* 9(NC)* 10(NC)*

### Layout directives
net class PWR: INT_VCC, NetQ20_5-6-7-8, PRE_VCC

### Notes on the sheet
- (near U14) Current sense
- I_SENSE swings from .3 to 3V (Vcc-.3V) as per DS
- Voltage sense
- Schematics Checked - Dec 03 2025
  - Pwr sw MOS layout makes sense
  - I sense connections ok
  - V sense ok
  - All port voltage labels are respected

### Library data of the parts
C155 = CMP-001-00058-1: as C66-C70 on sheet LM74910H_PINOUT; Min Operating Temperature: -55°C; Mounting Technology: Surface Mount; Pins: 2; Case/Package: 0402; RoHS Compliant: Yes; Max Operating Temperature: 85°C
D13 = CMP-1060-00750-1: as D?#4 on sheet LM704A0_3V3_PINOUT; RoHS: Pb-Free; ComponentLink2Description: Datasheet; PackageReference: SOD-523-2-502-01; DatasheetVersion: Rev. 10; ComponentLink1Description: Manufacturer URL; PackageVersion: Rev. E, 09/2010; ComponentLink3URL: http://www.onsemi.com/pub_link/Collateral/502-01.PDF; ComponentLink2URL: http://www.onsemi.cn/pub_link/Collateral/MM5Z2V4T1-D.PDF; Mounting Technology: Surface Mount; PartNumber: MM5Z3V3T1G; Packing: Tape and Reel; PackageDescription: 2-Pin SOD, Body 1.2 x 0.8 mm; ComponentLink1URL: http://www.onsemi.com/; ComponentLink3Description: Package Specification
Q20 Q21 = CMP-013-00018-2: as Q15 on sheet JETSON_PWR_MUX; Source: SISH615ADN-T1-GE3.SchLib; Design Item ID: CMP-013-00036-4; Component Type: Standard; Pins: 5
Q22 = CMP-2000-05968-1: N-Channel Enhancement Mode Mosfet, 50 V, 200 mA, -55 to 150 degC, 6-Pin SOT-323, RoHS, Tape and Reel; Typical Turn-Off Delay Time: 20ns; Number of Channels: 1Channel; Type: EnhancementModeFieldEffectTransistor; Brand: DiodesIncorporated; Vds - Drain-Source Breakdown Voltage: 75V; Vgs - Gate-Source Voltage: 20V; Rds On - Drain-Source Resistance: 1.4Ohms; Transistor Type: 1N-Channel; Configuration: Single; Unit Weight: 0.000212oz; Pd - Power Dissipation: 200mW; Id - Continuous Drain Current: 200mA; Forward Transconductance - Min: 0.1S; Manufacturer URL: http://www.diodes.com/; Series: BSS138; Package Description: 3-Pin Small Outline Transistor, Body 2 x 1.25 mm, Pitch 0.65 mm; Mounting Technology: SurfaceMount; Product Category: MOSFET; RoHS: True; Maximum Operating Temperature: +150C; Height: 1mm; Length: 2.2mm; Technology: Si; Width: 1.35mm; Datasheet URL: http://www.diodes.com/_files/datasheets/ds30206.pdf; Manufacturer: DiodesIncorporated; Package / Case: SOT-323-3; Typical Turn-On Delay Time: 20ns; Transistor Polarity: N-Channel; Factory Pack Quantity: 3000; Packaging: Reel; Product: MOSFETSmallSignal; Datasheet Version: Rev. 11-2, 09/2013; Package Reference: SOT323; Minimum Operating Temperature: -55C; Mounting Style: SMD/SMT; Channel Mode: Enhancement
R131-R137 = CMP-009-00002-14: Resistor
  R131 R132 R134 R137: Value: 100k
  R133 R135: Value: 1k
  R136: Value: 24k
U14 = CMP-1557-00002-1: Hall Effect Linear Current Sensor with Overcurrent Fault Output for <100 V Isolation Applications, 3 to 5.5 V, -31 to 31 A IP, -40 to 125 degC, 12-Pin QFN (EX), RoHS, Tape and Reel; IP Max: 31 A; VCC Min: 3 V; -3dB Bandwidth: 0.1 MHz; VCC Max: 5.5 V; IP Min: -31 A; Mounting Technology: Surface Mount; DatasheetVersion: Rev. 3; Temperature Min: -40 degC; ComponentLink1Description: Manufacturer URL; Packing: Tape and Reel; PartNumber: ACS711KEXLT-31AB-T; Temperature Max: 125 degC; ComponentLink2Description: Datasheet; ComponentLink3Description: Package Specification; RoHS: TRUE; ComponentLink1URL: http://www.allegromicro.com/; ComponentLink2URL: http://www.allegromicro.com/~/media/Files/Datasheets/ACS711-Datasheet.ashx?la=en; PackageDescription: 12-Pin Quad Flat No-Lead, Body 3 x 3 mm, Height 0.8 mm; ComponentLink3URL: http://www.allegromicro.com/~/media/Files/Datasheets/ACS711-Datasheet.ashx?la=en